# Altium schematic sheet OMD_F3_CAN_UWB_layout.SchDoc
size A4; DrawnBy: Philip Rowse
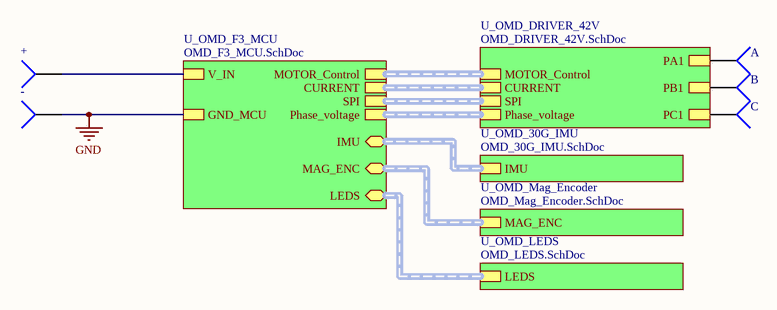
[diagram p0: OMD_F3_CAN_UWB_layout.SchDoc]

## Parts
+  BATT  (value not drawn)
-  GND  (value not drawn)  (no BOM)
A  Motor_pad  [MOTOR_PLUG_F_3.5]  (value not drawn)
B  Motor_pad  [MOTOR_PLUG_F_3.5]  (value not drawn)
C  Motor_pad  [MOTOR_PLUG_F_3.5]  (value not drawn)

## Sub-sheets
U_OMD_30G_IMU = OMD_30G_IMU.SchDoc: IMU (harness SPI_IMU)
U_OMD_DRIVER_42V = OMD_DRIVER_42V.SchDoc: SPI (harness SPI), MOTOR_Control (harness Motor control), CURRENT (harness I_FEEDBACK), PA1, PB1, PC1, Phase_voltage (harness Phase_voltage)
U_OMD_F3_MCU = OMD_F3_MCU.SchDoc: MOTOR_Control (harness Motor control), CURRENT (harness I_FEEDBACK), V_IN, GND_MCU, Phase_voltage (harness Phase_voltage), SPI (harness SPI1), IMU (harness SPI_IMU), LEDS (harness SPI_LEDs), MAG_ENC (harness SPI_ENC)
U_OMD_LEDS = OMD_LEDS.SchDoc: LEDS (harness SPI_LEDs)
U_OMD_Mag_Encoder = OMD_Mag_Encoder.SchDoc: MAG_ENC (harness SPI_ENC)

## Nets
GND: -.1 ; sheet U_OMD_F3_MCU/GND_MCU
Net+_1: +.1 ; sheet U_OMD_F3_MCU/V_IN
NetA_1: A.1 ; sheet U_OMD_DRIVER_42V/PA1
NetB_1: B.1 ; sheet U_OMD_DRIVER_42V/PB1
NetC_1: C.1 ; sheet U_OMD_DRIVER_42V/PC1

## Buses and harness runs
harness sheet U_OMD_30G_IMU/IMU = sheet U_OMD_F3_MCU/IMU
harness sheet U_OMD_DRIVER_42V/CURRENT = sheet U_OMD_F3_MCU/CURRENT
harness sheet U_OMD_DRIVER_42V/MOTOR_Control = sheet U_OMD_F3_MCU/MOTOR_Control
harness sheet U_OMD_DRIVER_42V/Phase_voltage = sheet U_OMD_F3_MCU/Phase_voltage
harness sheet U_OMD_DRIVER_42V/SPI = sheet U_OMD_F3_MCU/SPI
harness sheet U_OMD_F3_MCU/LEDS = sheet U_OMD_LEDS/LEDS
harness sheet U_OMD_F3_MCU/MAG_ENC = sheet U_OMD_Mag_Encoder/MAG_ENC

## Notes on the sheet
- Title
- Size:
- Date:
- A4
- Number:
- Time:
- Revision:
- Sheet
- of
- File:

## Library data of the parts
+ - A B C = Socket